# Altium schematic sheet Main.SchDoc
size A3
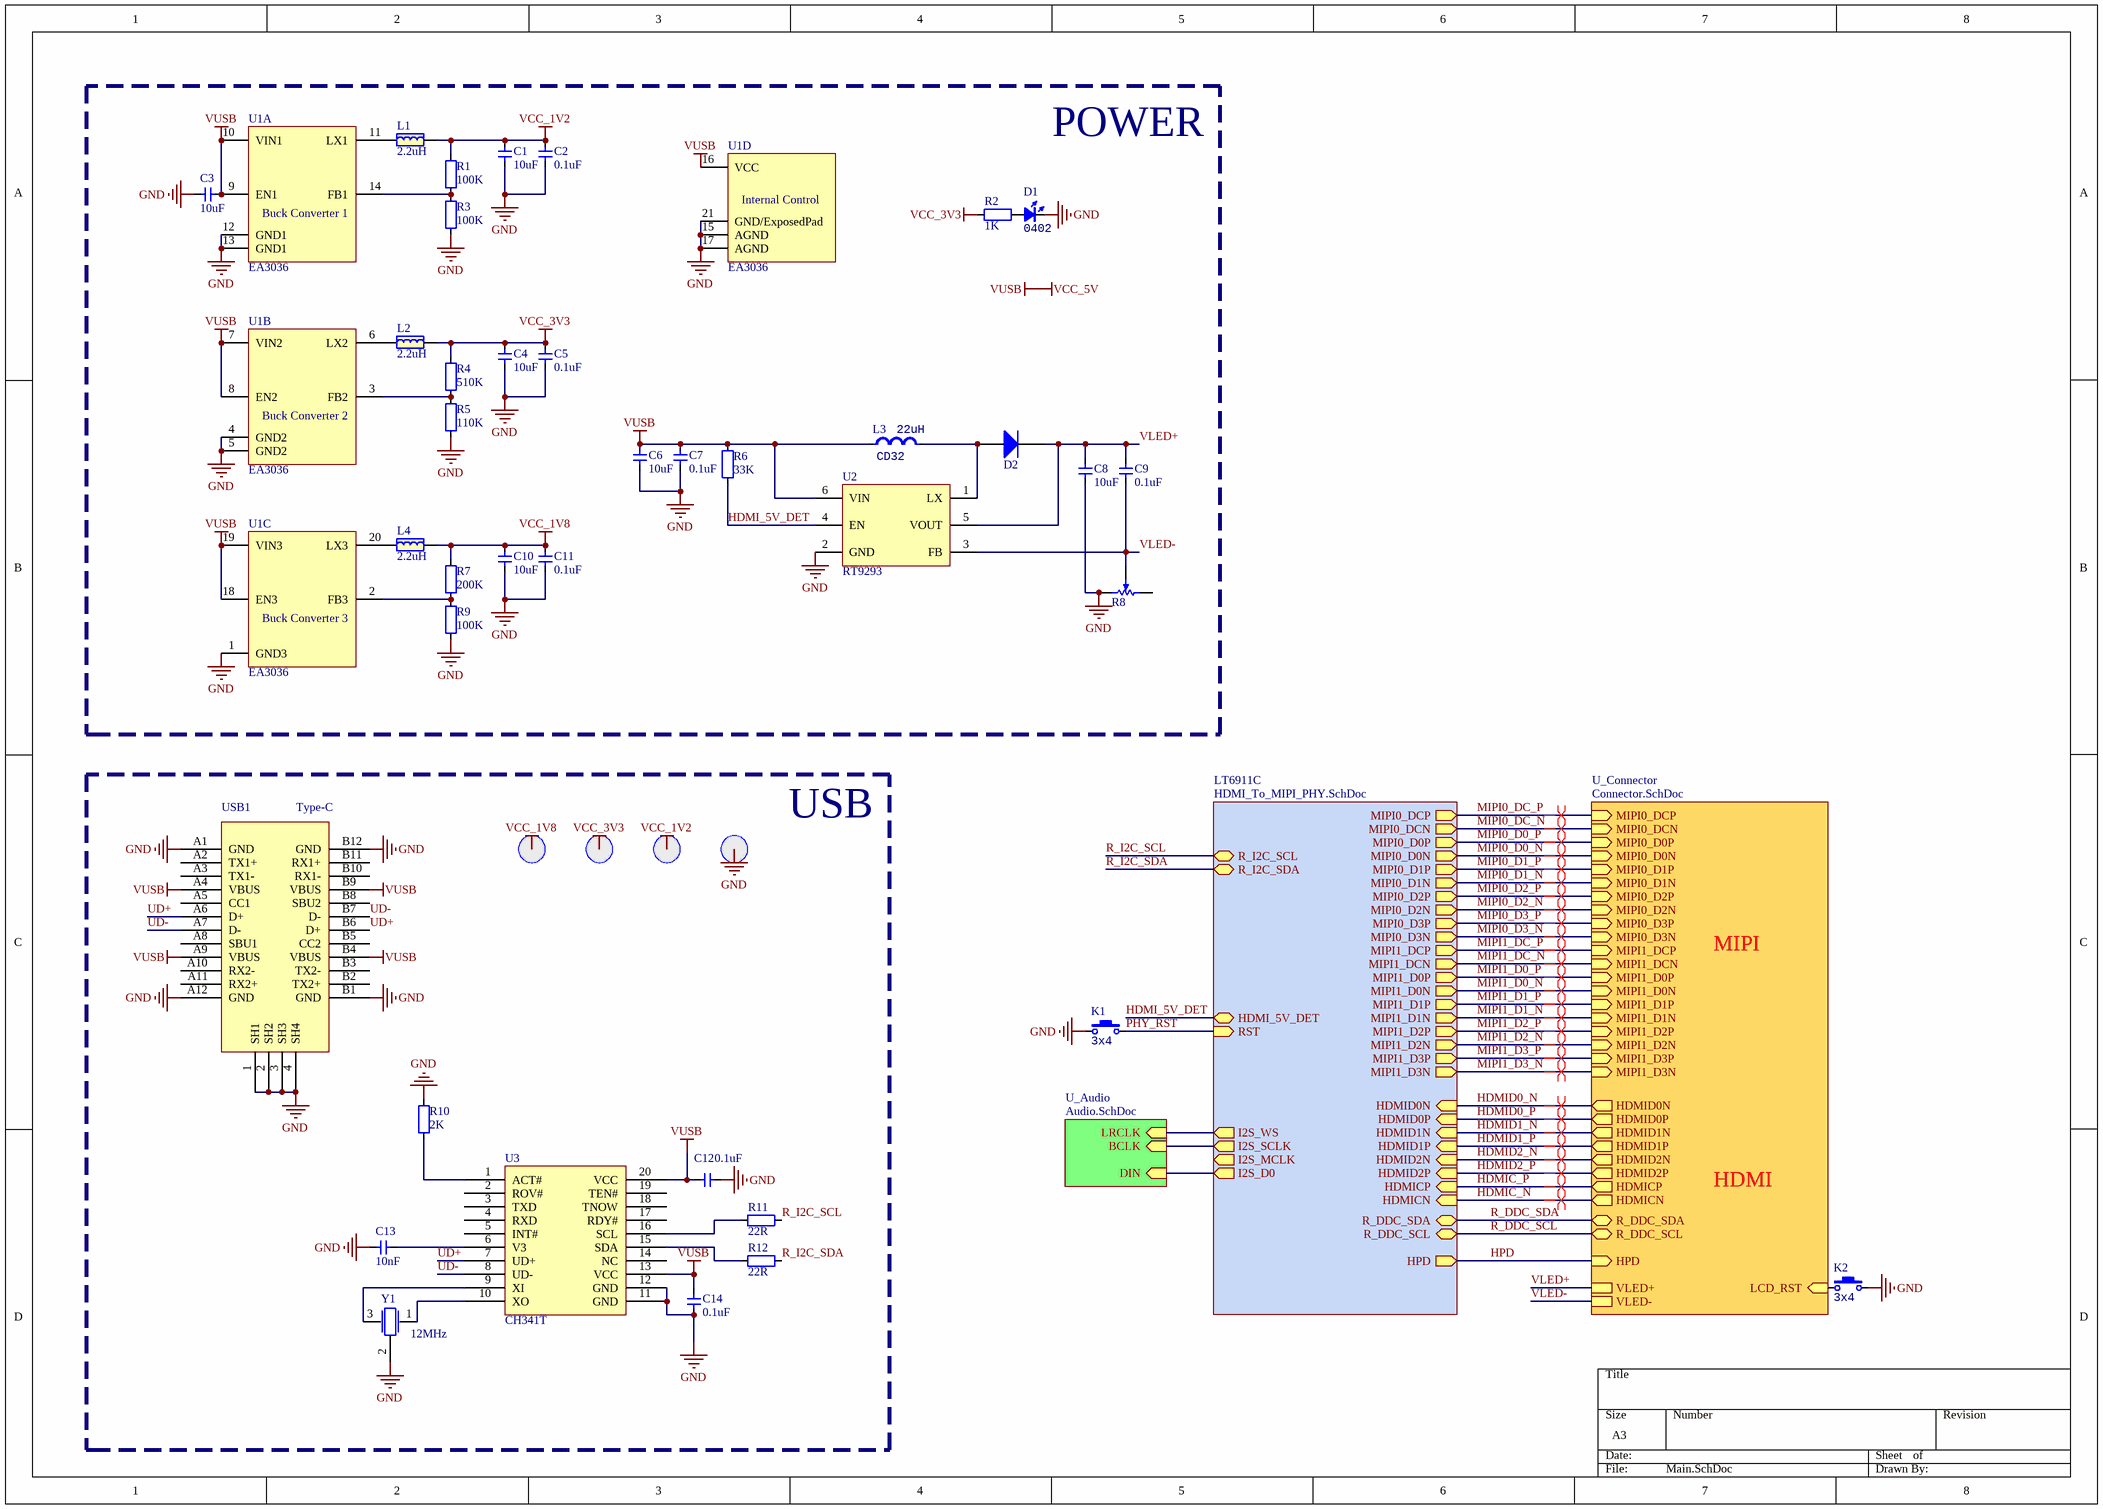
[diagram p0: Main.SchDoc]

## Parts
C1  10uF  [CAP_0402]
C2  0.1uF  [CAP_0402]
C3  10uF  [CAP_0402]
C4  10uF  [CAP_0402]
C5  0.1uF  [CAP_0402]
C6  10uF  [CAP_0402]
C7  0.1uF  [CAP_0402]
C8  10uF  [CAP_0402]
C9  0.1uF  [CAP_0402]
C10  10uF  [CAP_0402]
C11  0.1uF  [CAP_0402]
C12  0.1uF  [CAP_0402]
C13  10nF  [CAP_0402]
C14  0.1uF  [CAP_0402]
D1  Type: 0402  [LED_0402_RED]  (hidden comment: color?)
D2  二极管-5B5817WS  [SOD-323]  (value not drawn)
K1  value 3x4  [ButtonTACT_3x4x2_180H]  (hidden comment: TACT 2P)
K2  value 3x4  [ButtonTACT_3x4x2_180H]  (hidden comment: TACT 2P)
L1  2.2uH  [2520-L]
L2  2.2uH  [2520-L]
L3  value 22uH  [IND_CD32]  (hidden comment: CD32)
L4  2.2uH  [2520-L]
R1  100K  [RES_0402]
R2  1K  [RES_0402]
R3  100K  [RES_0402]
R4  510K  [RES_0402]
R5  110K  [RES_0402]
R6  33K  [RES_0402]
R7  200K  [RES_0402]
R8  电位器-贴片  [贴片电位器 3*3]  (value not drawn)
R9  100K  [RES_0402]
R10  2K  [RES_0402]
R11  22R  [RES_0402]
R12  22R  [RES_0402]
T1  测试点  [TEST_PT]  (value not drawn)
T2  测试点  [TEST_PT]  (value not drawn)
T3  测试点  [TEST_PT]  (value not drawn)
T4  测试点  [TEST_PT]  (value not drawn)
U1  EA3036  [QFN-20]  (parts A,B,C,D of 4)
U2  RT9293  [SOT23-6]
U3  CH341T  [SSOP-20]
USB1  Type-C  [Type-C-TOP]
Y1  12MHz  [晶振-3P]

## Blocks framed on the sheet
POWER: C1-C11 D1 D2 L1-L4 R1-R9 U1 U2
USB: C12-C14 R10-R12 T1-T4 U3 USB1 Y1

## Sub-sheets
LT6911C = HDMI_To_MIPI_PHY.SchDoc: R_I2C_SDA (bidir), R_I2C_SCL (bidir), HDMID0N (in), HDMID0P (in), HDMID1N (in), HDMID1P (in), HDMID2N (in), HDMID2P (in), HDMICP (in), HDMICN (in), R_DDC_SDA (bidir), R_DDC_SCL (bidir), MIPI0_DCP (out), MIPI0_DCN (out), MIPI0_D0P (out), MIPI0_D0N (out), MIPI0_D1P (out), MIPI0_D1N (out), MIPI0_D2P (out), MIPI0_D2N (out), MIPI0_D3P (out), MIPI0_D3N (out), MIPI1_DCP (out), MIPI1_DCN (out), MIPI1_D0P (out), MIPI1_D0N (out), MIPI1_D1P (out), MIPI1_D1N (out), MIPI1_D2P (out), MIPI1_D2N (out), MIPI1_D3P (out), MIPI1_D3N (out), RST (in), I2S_SCLK (out), HPD (out), I2S_D0 (out), HDMI_5V_DET (bidir), I2S_MCLK (out), I2S_WS (out)
U_Audio = Audio.SchDoc: BCLK (in), LRCLK (in), DIN (in)
U_Connector = Connector.SchDoc: MIPI0_DCP (in), MIPI0_DCN (in), MIPI0_D0P (in), MIPI0_D0N (in), MIPI0_D1P (in), MIPI0_D1N (in), MIPI0_D2P (in), MIPI0_D2N (in), MIPI0_D3P (in), MIPI0_D3N (in), MIPI1_DCP (in), MIPI1_DCN (in), MIPI1_D0P (in), MIPI1_D0N (in), MIPI1_D1P (in), MIPI1_D1N (in), MIPI1_D2P (in), MIPI1_D2N (in), MIPI1_D3P (in), MIPI1_D3N (in), R_DDC_SDA (bidir), R_DDC_SCL (bidir), HDMICP (out), HDMICN (out), HDMID0N (out), HDMID2P (out), HDMID1N (out), HDMID0P (out), HDMID1P (out), HDMID2N (out), HPD (in), VLED+, VLED-, LCD_RST (in)

## Nets
GND: C1.2 C2.2 C3.1 C4.2 C5.2 C6.1 C7.1 C8.1 C10.2 C11.2 C12.2 C13.2 C14.2 D1.2(K) K1.1 K2.2 R3.1 R5.1 R8.1(+) R9.1 R10.1 T4.0 U1.1(GND3) U1.4(GND2) U1.5(GND2) U1.12(GND1) U1.13(GND1) U1.15(AGND) U1.17(AGND) U1.21(GND/ExposedPad) U2.2(GND) U3.11(GND) U3.12(GND) USB1.1(SH1) USB1.2(SH2) USB1.3(SH3) USB1.4(SH4) USB1.A1(GND) USB1.A12(GND) USB1.B1(GND) USB1.B12(GND) Y1.2
VCC_1V2: C1.1 C2.1 L1.2 R1.2 T3.0
VCC_1V8: C10.1 C11.1 L4.2 R7.2 T1.0
VCC_3V3: C4.1 C5.1 L2.2 R2.1 R4.2 T2.0
VCC_5V: C3.2 C6.2 C7.2 C12.1 C14.1 L3.1 R6.2 U1.7(VIN2) U1.8(EN2) U1.9(EN1) U1.10(VIN1) U1.16(VCC) U1.18(EN3) U1.19(VIN3) U2.6(VIN) U3.13(VCC) U3.20(VCC) USB1.A4(VBUS) USB1.A9(VBUS) USB1.B4(VBUS) USB1.B9(VBUS)  [also labelled VUSB]
HDMI_5V_DET: R6.1 U2.4(EN) ; sheet LT6911C/HDMI_5V_DET
HDMIC_N: sheet LT6911C/HDMICN, sheet U_Connector/HDMICN
HDMIC_P: sheet LT6911C/HDMICP, sheet U_Connector/HDMICP
HDMID0_N: sheet LT6911C/HDMID0N, sheet U_Connector/HDMID0N
HDMID0_P: sheet LT6911C/HDMID0P, sheet U_Connector/HDMID0P
HDMID1_N: sheet LT6911C/HDMID1N, sheet U_Connector/HDMID1N
HDMID1_P: sheet LT6911C/HDMID1P, sheet U_Connector/HDMID1P
HDMID2_N: sheet LT6911C/HDMID2N, sheet U_Connector/HDMID2N
HDMID2_P: sheet LT6911C/HDMID2P, sheet U_Connector/HDMID2P
HPD: sheet LT6911C/HPD, sheet U_Connector/HPD
MIPI0_D0_N: sheet LT6911C/MIPI0_D0N, sheet U_Connector/MIPI0_D0N
MIPI0_D0_P: sheet LT6911C/MIPI0_D0P, sheet U_Connector/MIPI0_D0P
MIPI0_D1_N: sheet LT6911C/MIPI0_D1N, sheet U_Connector/MIPI0_D1N
MIPI0_D1_P: sheet LT6911C/MIPI0_D1P, sheet U_Connector/MIPI0_D1P
MIPI0_D2_N: sheet LT6911C/MIPI0_D2N, sheet U_Connector/MIPI0_D2N
MIPI0_D2_P: sheet LT6911C/MIPI0_D2P, sheet U_Connector/MIPI0_D2P
MIPI0_D3_N: sheet LT6911C/MIPI0_D3N, sheet U_Connector/MIPI0_D3N
MIPI0_D3_P: sheet LT6911C/MIPI0_D3P, sheet U_Connector/MIPI0_D3P
MIPI0_DC_N: sheet LT6911C/MIPI0_DCN, sheet U_Connector/MIPI0_DCN
MIPI0_DC_P: sheet LT6911C/MIPI0_DCP, sheet U_Connector/MIPI0_DCP
MIPI1_D0_N: sheet LT6911C/MIPI1_D0N, sheet U_Connector/MIPI1_D0N
MIPI1_D0_P: sheet LT6911C/MIPI1_D0P, sheet U_Connector/MIPI1_D0P
MIPI1_D1_N: sheet LT6911C/MIPI1_D1N, sheet U_Connector/MIPI1_D1N
MIPI1_D1_P: sheet LT6911C/MIPI1_D1P, sheet U_Connector/MIPI1_D1P
MIPI1_D2_N: sheet LT6911C/MIPI1_D2N, sheet U_Connector/MIPI1_D2N
MIPI1_D2_P: sheet LT6911C/MIPI1_D2P, sheet U_Connector/MIPI1_D2P
MIPI1_D3_N: sheet LT6911C/MIPI1_D3N, sheet U_Connector/MIPI1_D3N
MIPI1_D3_P: sheet LT6911C/MIPI1_D3P, sheet U_Connector/MIPI1_D3P
MIPI1_DC_N: sheet LT6911C/MIPI1_DCN, sheet U_Connector/MIPI1_DCN
MIPI1_DC_P: sheet LT6911C/MIPI1_DCP, sheet U_Connector/MIPI1_DCP
PHY_RST: K1.2 ; sheet LT6911C/RST
R_DDC_SCL: sheet LT6911C/R_DDC_SCL, sheet U_Connector/R_DDC_SCL
R_DDC_SDA: sheet LT6911C/R_DDC_SDA, sheet U_Connector/R_DDC_SDA
R_I2C_SCL: R11.2 ; sheet LT6911C/R_I2C_SCL
R_I2C_SDA: R12.2 ; sheet LT6911C/R_I2C_SDA
UD+: U3.7(UD+) USB1.A6(D+) USB1.B6(D+)
UD-: U3.8(UD-) USB1.A7(D-) USB1.B7(D-)
VLED+: C8.2 C9.2 D2.2(K) U2.5(VOUT) ; sheet U_Connector/VLED+
VLED-: C9.1 R8.3(W) U2.3(FB) ; sheet U_Connector/VLED-
NetC13_1: C13.1 U3.6(V3)
NetD1_1: D1.1(A) R2.2
NetD2_1: D2.1(A) L3.2 U2.1(LX)
NetK2_1: K2.1 ; sheet U_Connector/LCD_RST
NetL1_1: L1.1 U1.11(LX1)
NetL2_1: L2.1 U1.6(LX2)
NetL4_1: L4.1 U1.20(LX3)
NetR1_1: R1.1 R3.2 U1.14(FB1)
NetR4_1: R4.1 R5.2 U1.3(FB2)
NetR7_1: R7.1 R9.2 U1.2(FB3)
NetR10_2: R10.2 U3.1(ACT#)
NetR11_1: R11.1 U3.16(SCL)
NetR12_1: R12.1 U3.15(SDA)
NetU3_9: U3.9(XI) Y1.3
NetU3_10: U3.10(XO) Y1.1
(unnamed): sheet LT6911C/I2S_SCLK, sheet U_Audio/BCLK
(unnamed): sheet LT6911C/I2S_D0, sheet U_Audio/DIN
(unnamed): sheet LT6911C/I2S_WS, sheet U_Audio/LRCLK

Not connected (* = marked no-connect by the designer): R8 2(-); U3 2(ROV#) 3(TXD) 4(RXD) 5(INT#) 14(NC) 17(RDY#) 18(TNOW) 19(TEN#); USB1 A2(TX1+) A3(TX1-) A5(CC1) A8(SBU1) A10(RX2-) A11(RX2+) B2(TX2+) B3(TX2-) B5(CC2) B8(SBU2) B10(RX1-) B11(RX1+)

## Layout directives
differential pair: HDMIC_N, HDMIC_P, HDMID0_N, HDMID0_P, HDMID1_N, HDMID1_P, HDMID2_N, HDMID2_P, MIPI0_D0_N, MIPI0_D0_P, MIPI0_D1_N, MIPI0_D1_P, MIPI0_D2_N, MIPI0_D2_P, MIPI0_D3_N, MIPI0_D3_P, MIPI0_DC_N, MIPI0_DC_P, MIPI1_D0_N, MIPI1_D0_P, MIPI1_D1_N, MIPI1_D1_P, MIPI1_D2_N, MIPI1_D2_P, MIPI1_D3_N, MIPI1_D3_P, MIPI1_DC_N, MIPI1_DC_P

## Notes on the sheet
- MIPI
- HDMI
- (in symbol EA3036, part A) Buck Converter 1
- (in symbol EA3036, part B) Buck Converter 2
- (in symbol EA3036, part C) Buck Converter 3
- (in symbol EA3036, part D) Internal Control

## Library data of the parts
C1-C14 = 电容-0402: Capacitor; Value: 0.1u
D1 = LED_0402: LED; Value: color?
D2 = 二极管-5B5817WS: 40V
K1 K2 = ButtonTACT_3x4x2_180: Button; type: TACT 2P
L1 L2 L4 = 电感-2520: 磁珠
L3 = Ind_CD32: Inductor; Specification: ±5% 100mA; Manufacturer: *; Type: CD32
R1-R7 R9 R10 = 电阻-0402: Resistor; Value: 22R
R11 R12 = 电阻-0402: Resistor; Value: 22R
U1 = EA3036: EA3036 is a 3CH power management IC for applications powered by one Li-Ion battery or a DC 5V adapter.
U2 = RT9293: LCD-LED Driver
USB1 = USB-Type-C-TOP
Y1 = 晶振-3Pin: 村田贴片
R8 = 电位器-贴片: Published: 17-Dec-2003; DatasheetVersion: Oct-2003; PackageReference: POT4MM-2; Publisher: Altium Limited; PackageDescription: Square Trimming Potentiometer; ComponentLink1Description: Manufacturer Link; ComponentLink1URL: http://bourns.com/2/search.html